# EAGLE schematic a402-4069-overdrive (EAGLE 7.5.1)
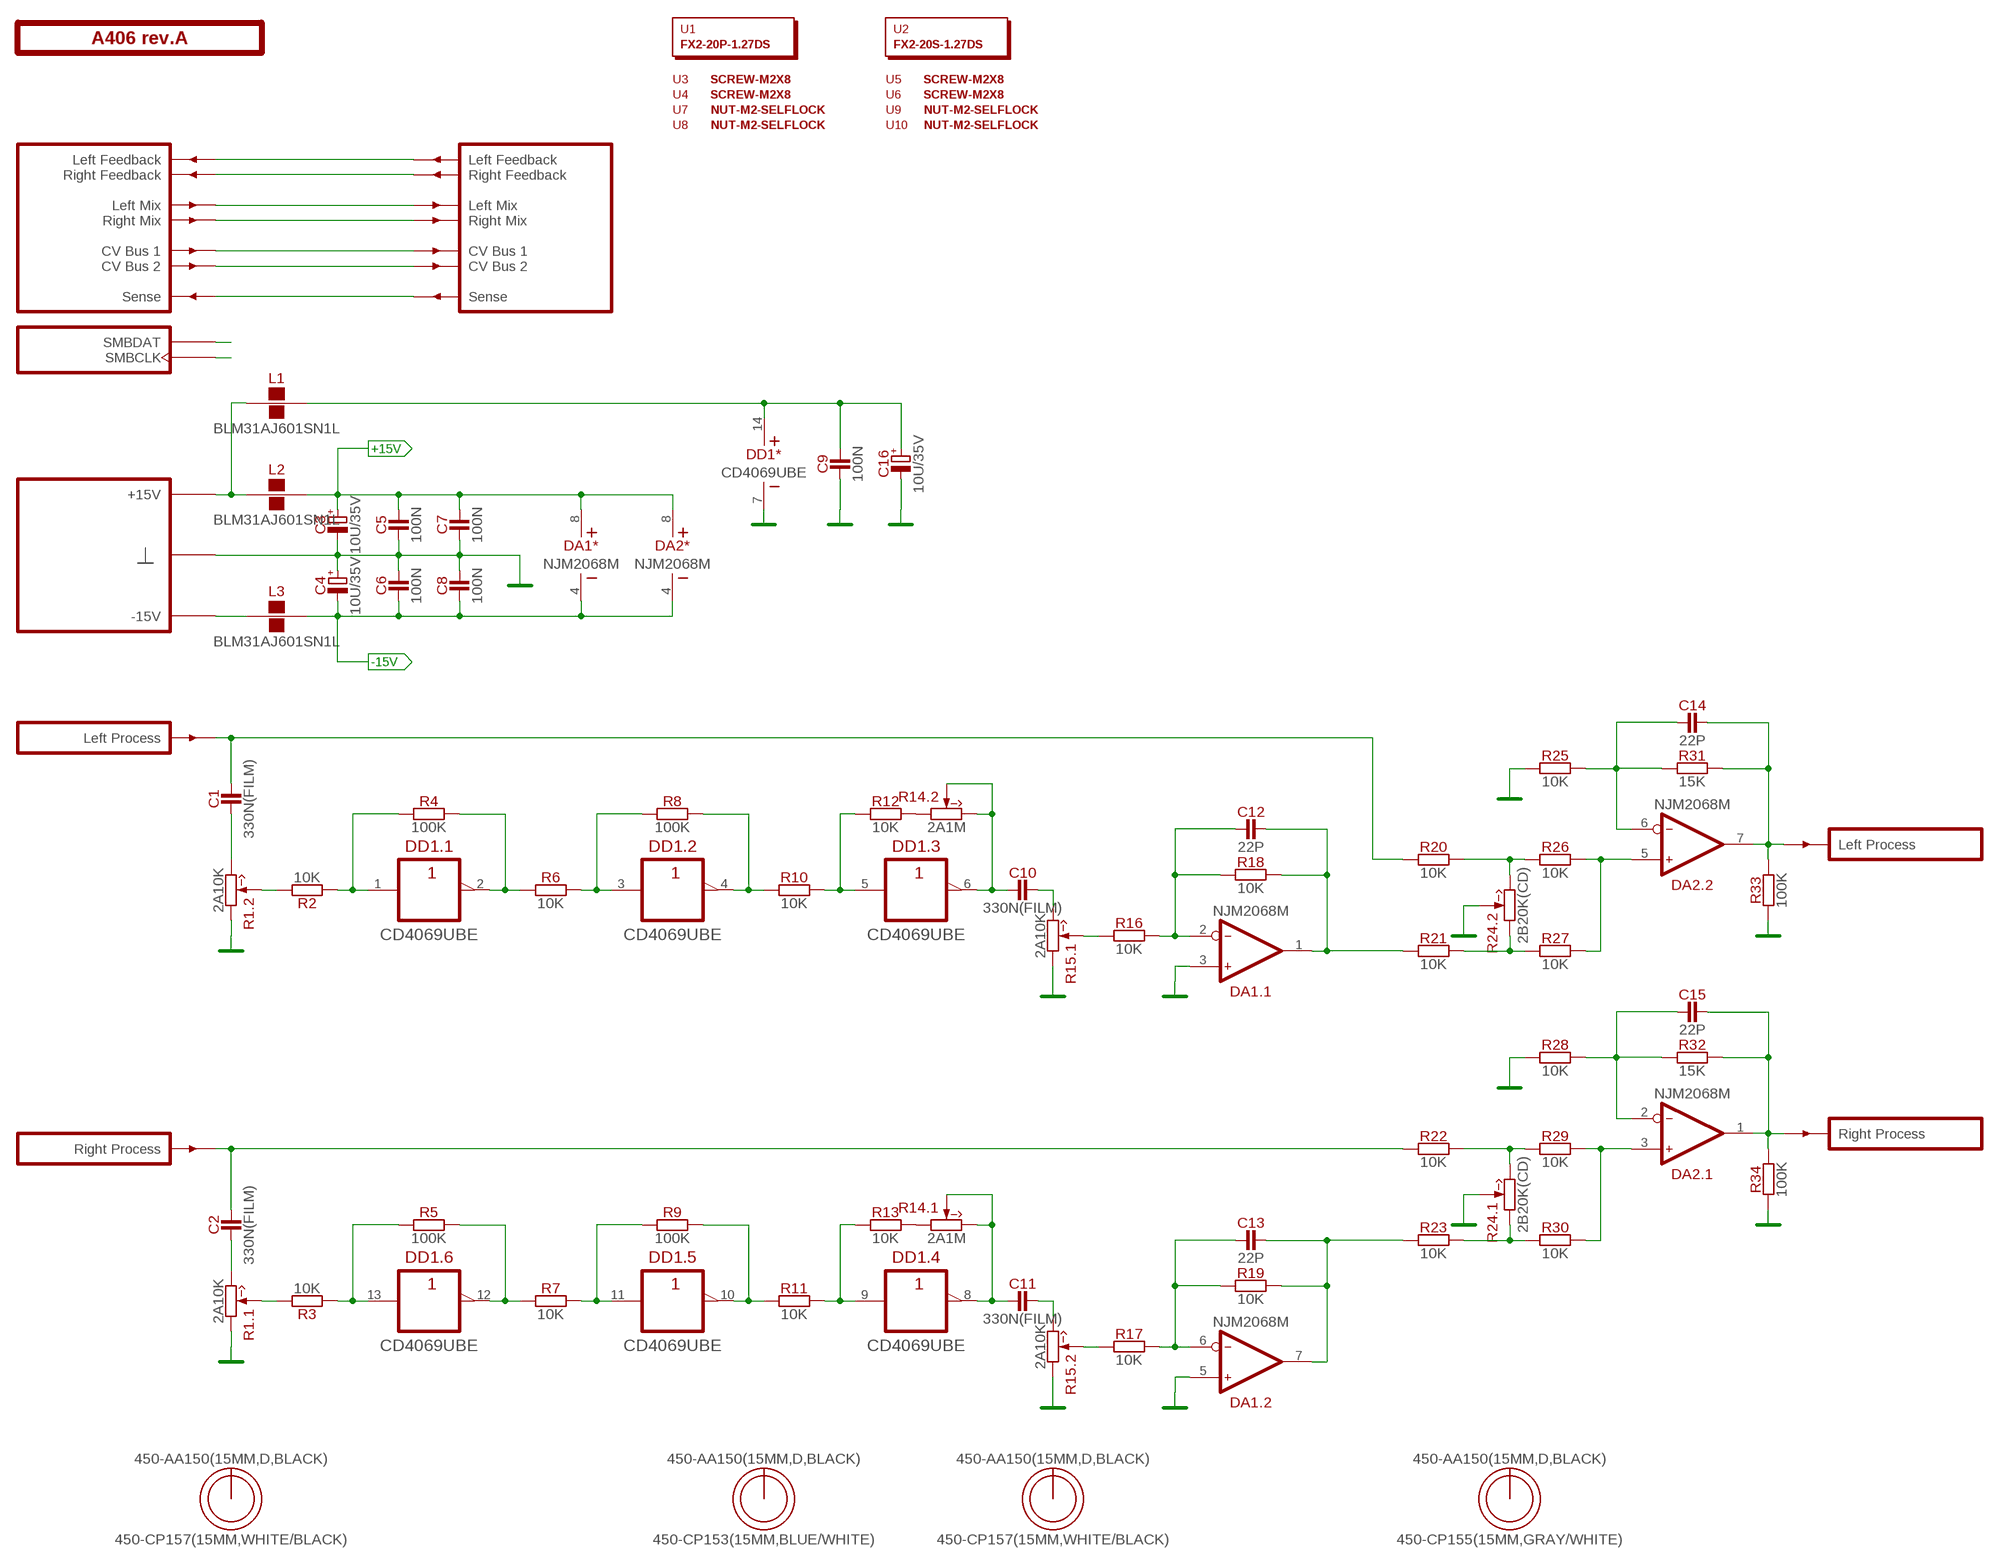
[diagram p0: schematic, sheet 1]

## Parts
C1  330N(FILM)  [C050-035X075]
C2  330N(FILM)  [C050-035X075]
C3  10U/35V  [E2-5]
C4  10U/35V  [E2-5]
C5  100N  [C-0805]
C6  100N  [C-0805]
C7  100N  [C-0805]
C8  100N  [C-0805]
C9  100N  [C-0805]
C10  330N(FILM)  [C050-035X075]
C11  330N(FILM)  [C050-035X075]
C12  22P  [C-0805]
C13  22P  [C-0805]
C14  22P  [C-0805]
C15  22P  [C-0805]
C16  10U/35V  [E2-5]
DA1  NJM2068M  [SO-8]
DA2  NJM2068M  [SO-8]
DD1  CD4069UBE  [DIP-14]
L1  BLM31AJ601SN1L  [1206]
L2  BLM31AJ601SN1L  [1206]
L3  BLM31AJ601SN1L  [1206]
O2  450-AA150(15MM,D,BLACK)  [EMPTY]
O3  450-CP157(15MM,WHITE/BLACK)  [EMPTY]
O4  450-AA150(15MM,D,BLACK)  [EMPTY]
O5  450-CP153(15MM,BLUE/WHITE)  [EMPTY]
O6  450-AA150(15MM,D,BLACK)  [EMPTY]
O7  450-CP157(15MM,WHITE/BLACK)  [EMPTY]
O8  450-AA150(15MM,D,BLACK)  [EMPTY]
O9  450-CP155(15MM,GRAY/WHITE)  [EMPTY]
PCB1  A406 rev.A  ST2-BOARD-50  [ST2-BOARD-50]
R1  2A10K  [RV11-DUAL]
R2  10K  [R-0805]
R3  10K  [R-0805]
R4  100K  [R-0805]
R5  100K  [R-0805]
R6  10K  [R-0805]
R7  10K  [R-0805]
R8  100K  [R-0805]
R9  100K  [R-0805]
R10  10K  [R-0805]
R11  10K  [R-0805]
R12  10K  [R-0805]
R13  10K  [R-0805]
R14  2A1M  [RV11-DUAL]
R15  2A10K  [RV11-DUAL]
R16  10K  [R-0805]
R17  10K  [R-0805]
R18  10K  [R-0805]
R19  10K  [R-0805]
R20  10K  [R-0805]
R21  10K  [R-0805]
R22  10K  [R-0805]
R23  10K  [R-0805]
R24  2B20K(CD)  [RV11-DUAL]
R25  10K  [R-0805]
R26  10K  [R-0805]
R27  10K  [R-0805]
R28  10K  [R-0805]
R29  10K  [R-0805]
R30  10K  [R-0805]
R31  15K  [R-0805]
R32  15K  [R-0805]
R33  100K  [R-0805]
R34  100K  [R-0805]
U1  FX2-20P-1.27DS  [EMPTY]
U2  FX2-20S-1.27DS  [EMPTY]
U3  SCREW-M2X8  [EMPTY]
U4  SCREW-M2X8  [EMPTY]
U5  SCREW-M2X8  [EMPTY]
U6  SCREW-M2X8  [EMPTY]
U7  NUT-M2-SELFLOCK  [EMPTY]
U8  NUT-M2-SELFLOCK  [EMPTY]
U9  NUT-M2-SELFLOCK  [EMPTY]
U10  NUT-M2-SELFLOCK  [EMPTY]

## Nets
+15V [power]: C3.+ C5.2 C7.2 DA1.8(*:V+) DA2.8(*:V+) L2.2
-15V [power]: C4.- C6.1 C8.1 DA1.4(*:V-) DA2.4(*:V-) L3.2
FBK_LEFT: PCB1.ALFBK'(LFBK') PCB1.ALFBK(LFBK)
FBK_RIGHT: PCB1.ARFBK'(RFBK') PCB1.ARFBK(RFBK)
GND: C3.- C4.+ C5.1 C6.2 C7.1 C8.2 C9.1 C16.- DA1.3(.1:IN+) DA1.5(.2:IN+) DD1.7(*:V-) PCB1.B4'(GND) PCB1.B4(GND) PCB1.B5'(GND) PCB1.B5(GND) PCB1.B6'(GND) PCB1.B6(GND) PCB1.B7'(GND) PCB1.B7(GND) PCB1.B8'(GND) PCB1.B8(GND) R1.1'(.2:CCW) R1.1(.1:CCW) R15.1'(.2:CCW) R15.1(.1:CCW) R24.2'(.2:W) R24.2(.1:W) R25.1 R28.1 R33.2 R34.2
LMIX: PCB1.ALMIX'(LMIX') PCB1.ALMIX(LMIX)
N$1: C9.2 C16.+ DD1.14(*:V+) L1.2
N$2: R12.2 R14.1'(.2:CCW)
N$3: R13.2 R14.1(.1:CCW)
N$4: C1.2 PCB1.BINL(INL) R20.1
N$5: C1.1 R1.3'(.2:CW)
N$6: DD1.1(.1:A) R2.1 R4.1
N$7: DD1.2(.1:Y) R4.2 R6.1
N$8: DD1.3(.2:A) R6.2 R8.1
N$9: DD1.4(.2:Y) R8.2 R10.1
N$10: DD1.5(.3:A) R10.2 R12.1
N$11: C10.1 DD1.6(.3:Y) R14.2'(.2:W) R14.3'(.2:CW)
N$12: C10.2 R15.3(.1:CW)
N$13: R15.2(.1:W) R16.1
N$14: C12.1 DA1.2(.1:IN-) R16.2 R18.1
N$15: R1.2'(.2:W) R2.2
N$16: PCB1.BSENSE'(SENSE') PCB1.BSENSE(SENSE)
N$17: C12.2 DA1.1(.1:OUT) R18.2 R21.1
N$18: C2.1 R1.3(.1:CW)
N$19: C2.2 PCB1.BINR(INR) R22.1
N$20: R1.2(.1:W) R3.2
N$21: DD1.13(.6:A) R3.1 R5.1
N$22: DD1.12(.6:Y) R5.2 R7.1
N$23: DD1.11(.5:A) R7.2 R9.1
N$24: DD1.10(.5:Y) R9.2 R11.1
N$26: DD1.9(.4:A) R11.2 R13.1
N$27: C11.1 DD1.8(.4:Y) R14.2(.1:W) R14.3(.1:CW)
N$28: C14.2 DA2.7(.2:OUT) PCB1.BOUTL'(OUTL) R31.2 R33.1
N$29: C11.2 R15.3'(.2:CW)
N$30: R15.2'(.2:W) R17.1
N$31: C13.1 DA1.6(.2:IN-) R17.2 R19.1
N$32: C13.2 DA1.7(.2:OUT) R19.2 R23.1
N$33: R20.2 R24.3'(.2:CW) R26.1
N$34: R22.2 R24.3(.1:CW) R29.1
N$35: C15.1 DA2.2(.1:IN-) R28.2 R32.1
N$36: L3.1 PCB1.A-15'(P-15V) PCB1.A-15(P-15V) PCB1.B-15'(P-15V) PCB1.B-15(P-15V)
N$37: C15.2 DA2.1(.1:OUT) PCB1.BOUTR'(OUTR) R32.2 R34.1
N$38: PCB1.ASMBDAT'(SMBDAT) PCB1.ASMBDAT(SMBDAT)
N$39: DA2.3(.1:IN+) R29.2 R30.2
N$40: R23.2 R24.1(.1:CCW) R30.1
N$41: PCB1.ACV1'(CV1') PCB1.ACV1(CV1)
N$42: PCB1.ACV2'(CV2') PCB1.ACV2(CV2)
N$43: PCB1.ASMBCLK'(SMBCLK) PCB1.ASMBCLK(SMBCLK)
N$61: DA2.5(.2:IN+) R26.2 R27.2
N$64: C14.1 DA2.6(.2:IN-) R25.2 R31.1
N$65: R21.2 R24.1'(.2:CCW) R27.1
P+15V: L1.1 L2.1 PCB1.A+15'(P+15V) PCB1.A+15(P+15V) PCB1.B+15'(P+15V) PCB1.B+15(P+15V)
RMIX: PCB1.ARMIX'(RMIX') PCB1.ARMIX(RMIX)

## Library data of the parts
C1 C2 C10 C11 = capacitors:?; MOUSER: 505-MKS2.33/63/10
C3 C4 C16 = capacitors-electrolytic:?; MOUSER: 647-USW1V100MDD
C5-C9 = capacitors:?; MOUSER: 77-VJ0805V104MXBPBC
C12-C15 = capacitors:?; MOUSER: 77-VJ0805A220GXACBC
DA1 DA2 = ic-jrc:NJM2068; MOUSER: 513-NJM2068M
DD1 = ic-logic:CD4069UB
L1-L3 = inductors:BLM31AJ601SN1L; MOUSER: 81-BLM31AJ601SN1L
O2 O4 O6 O8 = hardware:450-AA?; MOUSER: 450-AA150
O3 O7 = hardware:450-C?; MOUSER: 450-CP157
O5 = hardware:450-C?; MOUSER: 450-CP153
O9 = hardware:450-C?; MOUSER: 450-CP155
PCB1 = module-footprints:ST2-BOARD-?
R1 R15 = potentiometers:2**?; MOUSER: 688-RK12L12C0A0E
R2 R3 R6 R7 R10-R13 R16-R23 R25-R30 = resistors:?; MOUSER: 660-RK73H2ATTD1002F
R4 R5 R8 R9 R33 R34 = resistors:?; MOUSER: 660-RK73H2ATTD1003F
R14 = potentiometers:2**?; MOUSER: 317-2102F-1M
R24 = potentiometers:2**?; MOUSER: 688-RK12L1230C1M
R31 R32 = resistors:?; MOUSER: 660-RK73H2ATTD1502F
U1 = hardware:?; MOUSER: 798-FX2-20P-1.27DS71
U2 = hardware:?; MOUSER: 798-FX2-20S-1.27DS71
U3-U10 = hardware:*?